# Altium schematic sheet P08_BCS1_Revision Page.SchDoc
size A3; Date: 24.11.2011; CheckedBy: Finke; Author: Mierau; DrawnBy: Mierau; SheetNumber: 8; SheetTotal: 8; Anlage: 78; Beschreibung: Qseven; Kunde: 56; ProjektName: BCS1; ProjektNummer: 88xxx; Ersatz_fuer: 12; ersetzt_durch: 34; LKNummer: 6190202; ID_Nummer: 90
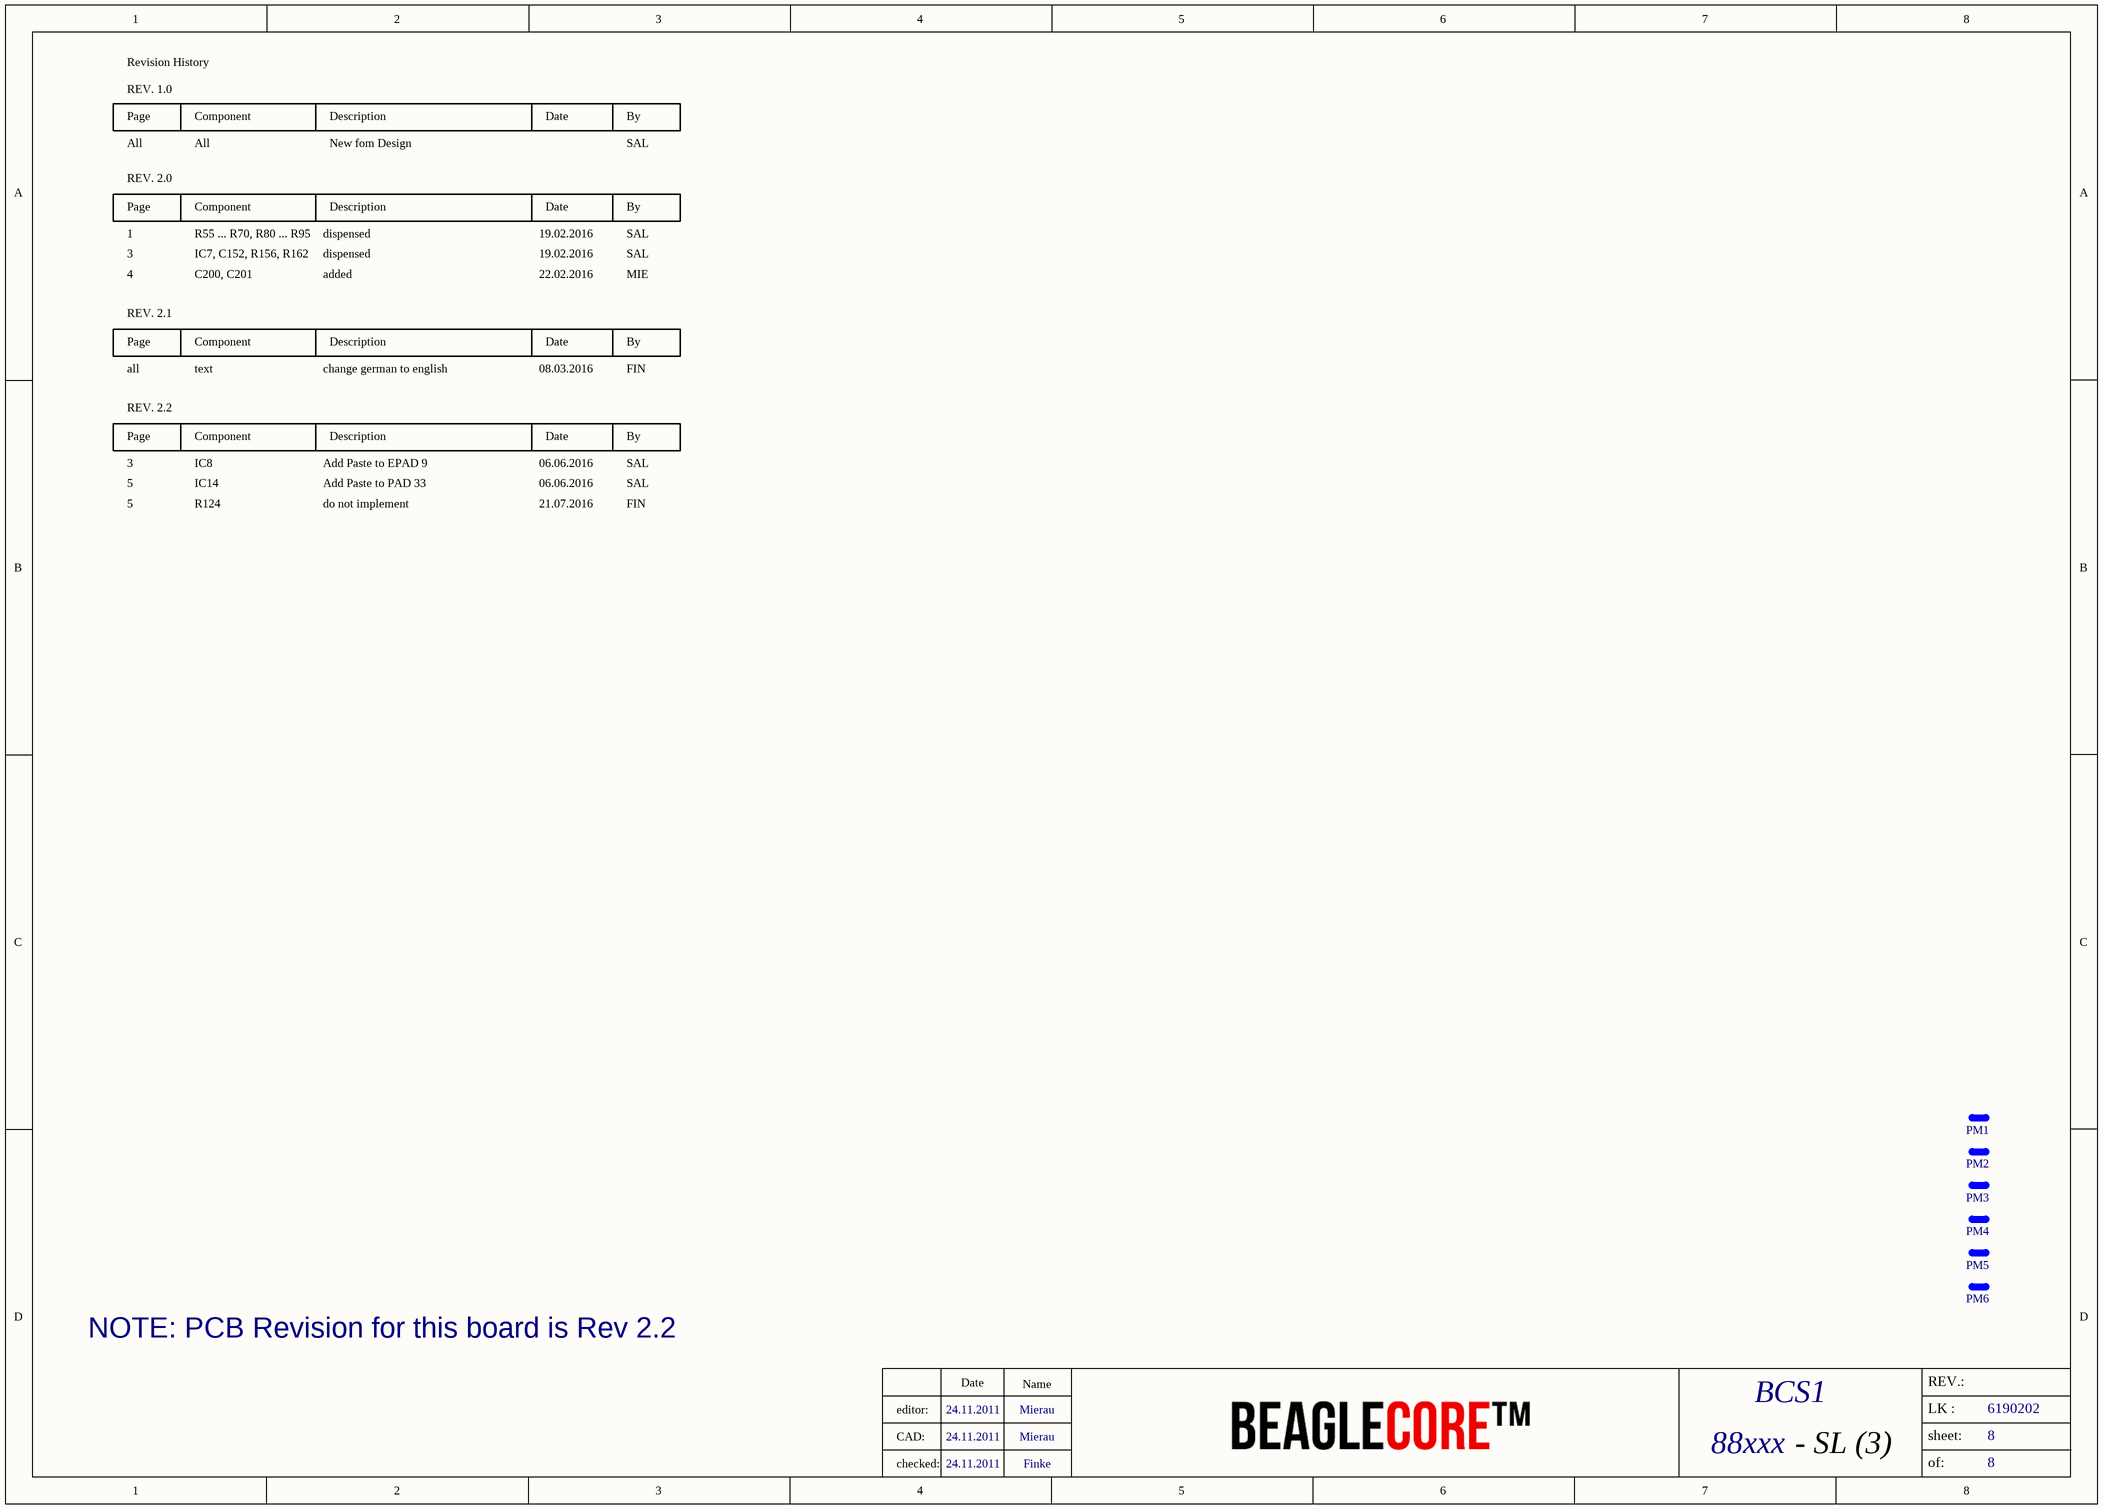
[diagram p0: P08_BCS1_Revision Page.SchDoc]

## Parts
PM1  PMR  [PASSER_RUND]  (value not drawn)
PM2  PMR  [PASSER_RUND]  (value not drawn)
PM3  PMR  [PASSER_RUND]  (value not drawn)
PM4  PMR  [PASSER_RUND]  (value not drawn)
PM5  PMR  [PASSER_RUND]  (value not drawn)
PM6  PMR  [PASSER_RUND]  (value not drawn)

## Notes on the sheet
- Revision History
- REV. 1.0
- Page
- All
- REV. 2.0
- Component
- Description
- New fom Design
- Date
- By
- SAL
- 1
- R55 ... R70, R80 ... R95
- dispensed
- 19.02.2016
- 3
- 4
- REV. 2.1
- IC7, C152, R156, R162
- C200, C201
- added
- 22.02.2016
- MIE
- all
- text
- change german to english
- 08.03.2016
- FIN
- REV. 2.2
- 5
- IC14
- IC8
- R124
- Add Paste to PAD 33
- Add Paste to EPAD 9
- do not implement
- 06.06.2016
- 21.07.2016
- NOTE: PCB Revision for this board is Rev 2.2
- Name
- REV.:
- editor:
- CAD:
- - SL (3)
- sheet:
- LK :
- checked:
- of:

## Library data of the parts
PM1-PM6 = A_PMR: Passer Markierung rund; Value: PMR